# EAGLE design IoT_2015-1 (EAGLE 7.2.0)
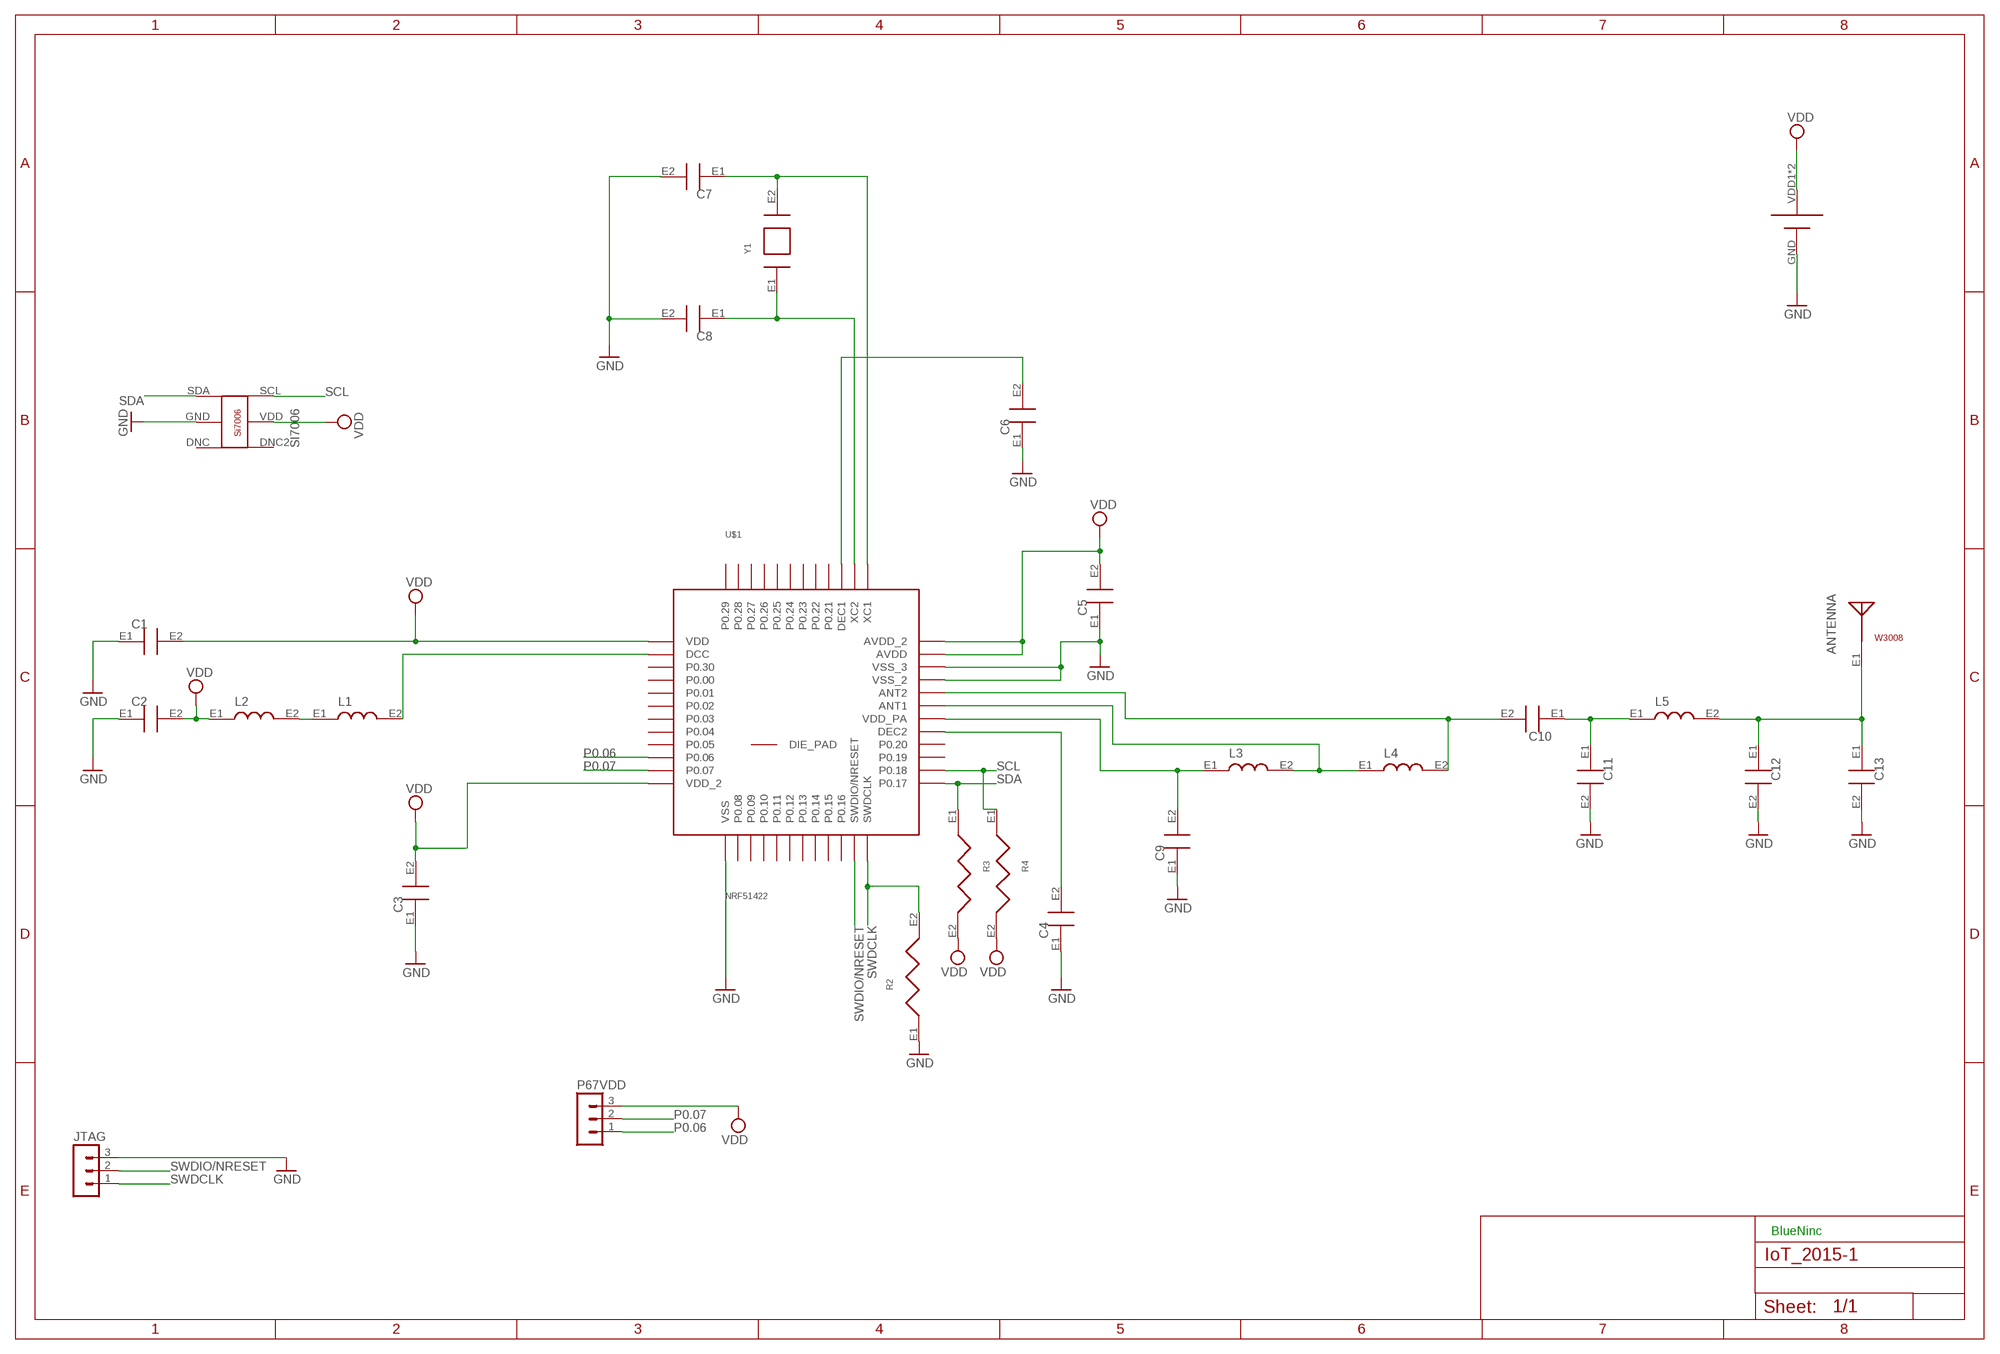
[diagram p0: schematic, sheet 1]

## Parts
ANTENNA  W3008  [W3008]
BATTERY  BAT-HLD-001  [BAT-HLD-001]
C1  VJ1603_W1BC  [VJ1603_W1BC]
C2  VJ1603_W1BC  [VJ1603_W1BC]
C3  VJ1603_W1BC  [VJ1603_W1BC]
C4  VJ1603_W1BC  [VJ1603_W1BC]
C5  VJ1603_W1BC  [VJ1603_W1BC]
C6  VJ1603_W1BC  [VJ1603_W1BC]
C7  VJ1603_W1BC  [VJ1603_W1BC]
C8  VJ1603_W1BC  [VJ1603_W1BC]
C9  VJ1603_W1BC  [VJ1603_W1BC]
C10  VJ1603_W1BC  [VJ1603_W1BC]
C11  VJ1603_W1BC  [VJ1603_W1BC]
C12  VJ1603_W1BC  [VJ1603_W1BC]
C13  VJ1603_W1BC  [VJ1603_W1BC]
JTAG  MA03-1  [MA03-1]
L1  JTI_CAT_2012_INDUCTORS_CHIP-242427  [JTI_CAT_2012_INDUCTORS_CHIP-242427]
L2  JTI_CAT_2012_INDUCTORS_CHIP-242427  [JTI_CAT_2012_INDUCTORS_CHIP-242427]
L3  JTI_CAT_2012_INDUCTORS_CHIP-242427  [JTI_CAT_2012_INDUCTORS_CHIP-242427]
L4  JTI_CAT_2012_INDUCTORS_CHIP-242427  [JTI_CAT_2012_INDUCTORS_CHIP-242427]
L5  JTI_CAT_2012_INDUCTORS_CHIP-242427  [JTI_CAT_2012_INDUCTORS_CHIP-242427]
P67VDD  MA03-1  [MA03-1]
R2  ERJ-3GEYJ103V  [ERJ-3GEYJ103V]
R3  ERJ-3GEYJ103V  [ERJ-3GEYJ103V]
R4  ERJ-3GEYJ103V  [ERJ-3GEYJ103V]
SI7006  SI7006-A20-IM  [SI7006-A20-IM]
U$1  NRF51422  [QFN48]
Y1  ABLS-16.000MHZ-B4-T  [ABLS-16.000MHZ-B4-T]

## Nets
GND: BATTERY.GND C1.E1 C2.E1 C3.E1 C4.E1 C5.E1 C6.E1 C7.E2 C8.E2 C9.E1 C11.E2 C12.E2 C13.E2 JTAG.3 R2.E1 SI7006.GND U$1.13(VSS) U$1.33(VSS_2) U$1.34(VSS_3)
N$1: L1.E1 L2.E2
N$2: L1.E2 U$1.2(DCC)
N$3: C4.E2 U$1.29(DEC2)
N$4: ANTENNA.E1 C12.E1 C13.E1 L5.E2
N$5: C9.E2 L3.E1 U$1.30(VDD_PA)
N$6: L3.E2 L4.E1 U$1.31(ANT1)
N$7: C10.E2 L4.E2 U$1.32(ANT2)
N$8: C6.E2 U$1.39(DEC1)
N$9: C8.E1 U$1.38(XC2) Y1.E1
N$10: C7.E1 U$1.37(XC1) Y1.E2
N$11: C10.E1 C11.E1 L5.E1
P0.06: P67VDD.1 U$1.10(P0.06)
P0.07: P67VDD.2 U$1.11(P0.07)
SCL: R4.E1 SI7006.SCL U$1.26(P0.18)
SDA: R3.E1 SI7006.SDA U$1.25(P0.17)
SWDCLK: JTAG.1 R2.E2 U$1.24(SWDCLK)
SWDIO/NRESET: JTAG.2 U$1.23(SWDIO/NRESET)
VDD: BATTERY.VDD1(VDD) BATTERY.VDD2(VDD) C1.E2 C2.E2 C3.E2 C5.E2 L2.E1 P67VDD.3 R3.E2 R4.E2 SI7006.VDD U$1.1(VDD) U$1.12(VDD_2) U$1.35(AVDD) U$1.36(AVDD_2)
Unconnected: SI7006.DNC SI7006.DNC2 U$1.3(P0.30) U$1.4(P0.00) U$1.5(P0.01) U$1.6(P0.02) U$1.7(P0.03) U$1.8(P0.04) U$1.9(P0.05) U$1.14(P0.08) U$1.15(P0.09) U$1.16(P0.10) U$1.17(P0.11) U$1.18(P0.12) U$1.19(P0.13) U$1.20(P0.14) U$1.21(P0.15) U$1.22(P0.16) U$1.27(P0.19) U$1.28(P0.20) U$1.40(P0.21) U$1.41(P0.22) U$1.42(P0.23) U$1.43(P0.24) U$1.44(P0.25) U$1.45(P0.26) U$1.46(P0.27) U$1.47(P0.28) U$1.48(P0.29) U$1.GND(DIE_PAD)

## Notes on the sheet
- BlueNinc

## Library data of the parts
ANTENNA = Pulse:W3008
BATTERY = BAT-HLD-001:BAT-HLD-001
C1-C13 = Vishay:VJ1603_W1BC
JTAG P67VDD = custom-con-lstb:MA03-1: PIN HEADER; OC_FARNELL: unknown; OC_NEWARK: unknown
L1-L5 = JohansonTechnology:JTI_CAT_2012_INDUCTORS_CHIP-242427
R2-R4 = Panasonic:ERJ-3GEYJ103V
SI7006 = SiliconLabs:SI7006-A20-IM
U$1 = NordicSemi:NRF51422: Bluetooth 4.0 Low Energy/2.4Ghz NORDIC SEMICONDUCTOR
Y1 = Abracon:ABLS-16.000MHZ-B4-T

## Board
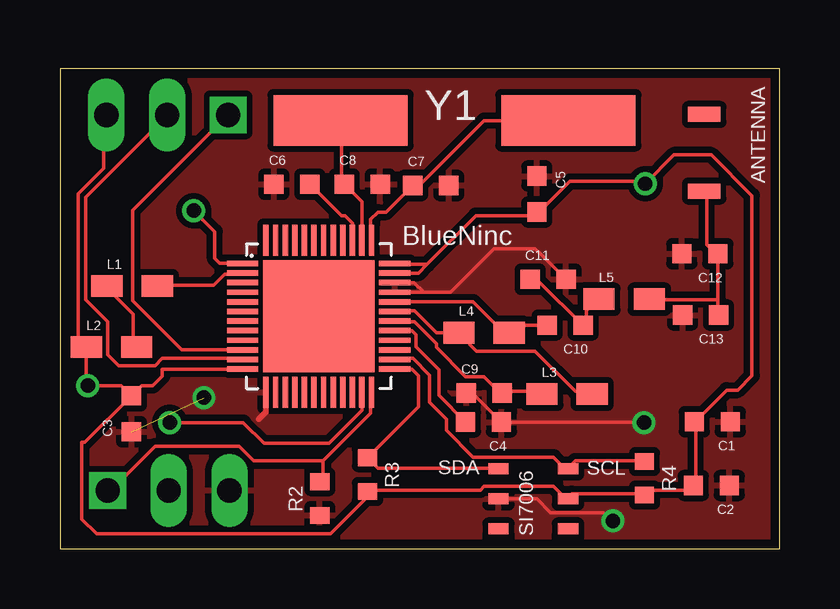
[diagram p1: board, top side]
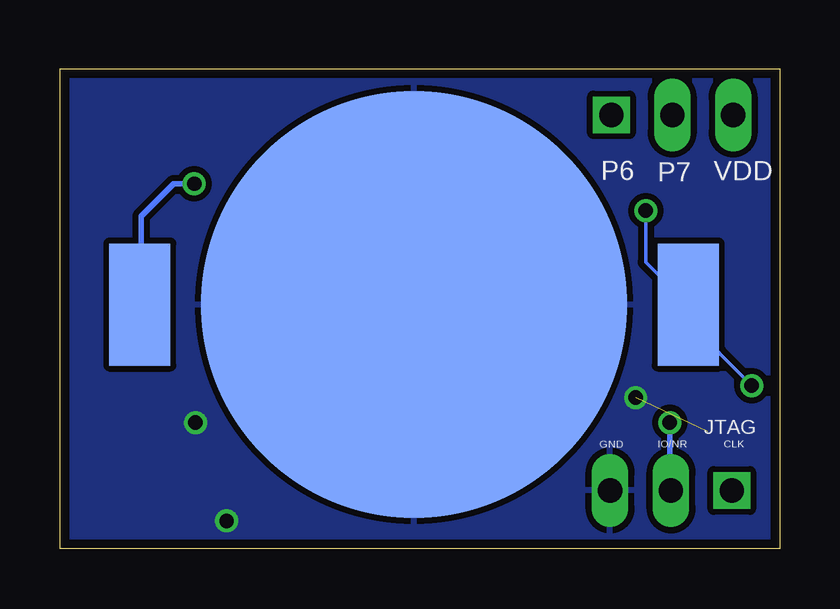
[diagram p2: board, bottom side, seen from below]

Size 30 x 20 mm. Coordinates in mm from the lower left corner, seen from the top.
Outline: 30,0 30,20 0,20 0,0 30,0
Copper layers (1*16): Top 0.0356mm / dielectric 1.5011mm / Bottom 0.0356mm
Design rules "LaenPCBOrder": minimum track width 6mil, minimum drill 13mil, track to track 6mil, track to pad 6mil, pad to pad 6mil, via to via 6mil, smd to smd 6mil, copper to edge 15mil, drill to drill 6mil, minimum pad ring 7mil, minimum via ring 7mil, stop-mask expansion 3mil, vias tented up to drill 0mil, thermal gap 10mil

### Footprints (pad centres in the part's own frame; a part is rotated, then mirrored left to right if it is on the bottom)
W3008 = smd 0.62 x 1.36: E1 -1.6,0; E2 1.6,0
BAT-HLD-001 = smd 17.78 x 17.78: GND 0,0 | smd 2.54 x 5.08: VDD1 -11.43,0; VDD2 11.43,0
VJ1603_W1BC = smd 0.8 x 0.8: E1 -0.75,0; E2 0.75,0
MA03-1 = drill 1.016 square: 1 -2.54,0 | drill 1.016 long: 2 0,0; 3 2.54,0
JTI_CAT_2012_INDUCTORS_CHIP-242427 = smd 1.3 x 0.9: E1 -1.05,0; E2 1.05,0
ERJ-3GEYJ103V = smd 0.7 x 0.8: E1 -0.7,0; E2 0.7,0
SI7006-A20-IM = smd 0.85 x 0.45: DNC -1.45,-1.25; DNC2 1.45,-1.25; GND -1.45,0; SCL 1.45,1.25; SDA -1.45,1.25; VDD 1.45,0
QFN48 = smd 1.3 x 0.226: 1 -3.17,2.2; 2 -3.17,1.8; 3 -3.17,1.4; 4 -3.17,1; 5 -3.17,0.6; 6 -3.17,0.2; 7 -3.17,-0.2; 8 -3.17,-0.6; 9 -3.17,-1; 10 -3.17,-1.4; 11 -3.17,-1.8; 12 -3.17,-2.2; 25 3.17,-2.2; 26 3.17,-1.8; 27 3.17,-1.4; 28 3.17,-1; 29 3.17,-0.6; 30 3.17,-0.2; 31 3.17,0.2; 32 3.17,0.6; 33 3.17,1; 34 3.17,1.4; 35 3.17,1.8; 36 3.17,2.2 | smd 0.226 x 1.3: 13 -2.2,-3.17; 14 -1.8,-3.17; 15 -1.4,-3.17; 16 -1,-3.17; 17 -0.6,-3.17; 18 -0.2,-3.17; 19 0.2,-3.17; 20 0.6,-3.17; 21 1,-3.17; 22 1.4,-3.17; 23 1.8,-3.17; 24 2.2,-3.17; 37 2.2,3.17; 38 1.8,3.17; 39 1.4,3.17; 40 1,3.17; 41 0.6,3.17; 42 0.2,3.17; 43 -0.2,3.17; 44 -0.6,3.17; 45 -1,3.17; 46 -1.4,3.17; 47 -1.8,3.17; 48 -2.2,3.17 | smd 4.66 x 4.66: GND 0,0
ABLS-16.000MHZ-B4-T = smd 5.588 x 2.108: E1 -4.75,0; E2 4.75,0

### Placement (x,y rotation side)
ANTENNA  26.86,16.49 90 top
BATTERY  15.24,10.16 0 bottom
C1  27.2,5.28 180 top
C2  27.16,2.63 180 top
C3  2.98,5.62 90 top
C4  17.66,5.27 180 top
C5  19.88,14.77 270 top
C6  9.67,15.18 0 top
C7  15.46,15.13 0 top
C8  12.6,15.18 0 top
C9  17.69,6.48 0 top
C10  21.06,9.31 180 top
C11  20.35,11.22 0 top
C12  26.68,12.28 180 top
C13  26.71,9.73 180 top
JTAG  4.53,2.42 0 top
L1  3.01,10.94 0 top
L2  2.15,8.39 0 top
L3  21.14,6.44 0 top
L4  17.68,8.99 0 top
L5  23.52,10.39 0 top
P67VDD  4.47,18.07 180 top
R2  10.83,2.08 90 top
R3  12.82,3.08 270 top
R4  24.37,2.93 270 top
SI7006  19.73,2.07 0 top
U$1  10.79,9.68 0 top
Y1  16.45,17.84 0 top

### Tracks (layer width: path | path; a pad name or v marks a point on that pad's centre or on a via)
GND  (via drill 0.6)  (1 unrouted)
  Top 0.152: C9.E1 17.2,6.48 C4.E1 24.33,5.27 v24.35,5.25 | SI7006.GND 19.88,2.07 20.45,1.5 22.65,1.5 22.7,1.45 22.75,1.45 v23.05,1.15 | U$1.33 15.17,10.68 | 15.17,10.68 16.28,10.68 18.1,12.5 19.8,12.5 19.95,12.35 19.97,12.35 C11.E2 | U$1.34 14.77,11.08 15.17,10.68
  Top 0.225: U$1.13 8.59,5.7 8.28,5.39
  other vias: 6,6.29
  pour Top (isolate 0.254): 0,0 0,20 30,20 30,0
  pour Bottom (isolate 0.254): 0,0 0,20 30,20 30,0
N$1
  Top 0.152: L2.E2 3.05,8.53 3.05,9.75 1.98,10.82 L1.E1
N$2
  Top 0.152: L1.E2 4.12,10.97 6.4,10.97 6.86,11.43 7.62,11.43 U$1.2
N$3
  Top 0.152: U$1.29 14.67,9.08 14.85,8.9 14.85,8.4 15.8,7.45 15.8,6.38 C4.E2
N$4
  Top 0.152: 27.43,10.36 27.43,9.75 C13.E1 | 27.43,10.36 27.43,12.19 C12.E1 27.28,12.34 26.98,12.65 26.98,14.78 ANTENNA.E1 | 27.43,10.36 24.69,10.36 L5.E2
N$5
  Top 0.152: L3.E1 19.96,6.55 18.44,6.55 C9.E2 18.29,6.55 17.68,7.16 16.92,7.16 15.7,8.38 15.7,8.53 14.78,9.45 14.02,9.45 U$1.30
N$6
  Top 0.152: U$1.31 14.02,9.91 14.78,9.91 15.7,8.99 16.61,8.99 L4.E1 16.76,8.84 17.37,8.23 19.81,8.23 21.49,6.55 22.1,6.55 L3.E2
N$7
  Top 0.152: C10.E2 20.27,9.3 19.05,9.3 18.75,8.99 L4.E2 18.47,9.25 18.25,9.25 17.22,10.28 U$1.32
N$8
  Top 0.152: C6.E2 10.52,15.09 11.73,13.87 11.89,13.87 12.19,13.56 12.19,12.95 U$1.39
N$9
  Top 0.152: Y1.E1 11.73,17.83 11.73,15.24 C8.E1 12.59,14.44 U$1.38
N$10
  Top 0.152: 14.63,15.09 C7.E1 | U$1.37 12.95,12.95 12.95,13.71 13.26,14.02 13.6,14.02 C7.E1 | C7.E1 14.78,15.24 15.09,15.24 17.68,17.83 21.18,17.83 Y1.E2
N$11
  Top 0.152: L5.E1 22.4,10.36 21.95,9.91 21.95,9.45 C10.E1 21.79,9.3 19.96,11.12 19.66,11.12 C11.E1
P0.06
  Top 0.152: U$1.10 5.07,8.28 3.03,10.32 3.03,14.09 P67VDD.1
P0.07
  Top 0.152: U$1.11 7.62,7.92 4.27,7.92 3.96,7.62 2.44,7.62 1.98,8.08 1.98,9.45 1.07,10.36 1.07,14.63 4.42,17.98 P67VDD.2
SCL
  Top 0.152: U$1.26 14.02,7.92 14.71,7.92 15.41,7.23 15.41,6.09 16.11,5.39 16.11,4.92 17.22,3.81 20.57,3.81 21.03,3.35 SI7006.SCL 21.18,3.35 21.49,3.66 24.34,3.66 R4.E1
SDA
  Top 0.152: 12.95,3.81 R3.E1 | U$1.25 13.87,7.47 14.67,7.47 14.95,7.19 14.95,5.91 R3.E1 | SI7006.SDA 18.14,3.35 13.26,3.35 12.95,3.66 R3.E1
SWDCLK
  Top 0.152: 10.97,3.66 10.97,2.9 R2.E2 | 10.97,3.66 12.95,5.64 12.95,6.4 U$1.24 | 10.97,3.66 8.08,3.66 7.47,4.27 3.96,4.27 2.13,2.44 JTAG.1
SWDIO/NRESET  (via drill 0.6)
  Top 0.152: U$1.23 12.59,5.76 11.21,4.38 8.51,4.38 7.64,5.25 v4.58,5.25
  Bottom 0.225: v4.58,5.25 4.58,2.47 JTAG.2
VDD  (via drill 0.6)
  Top 0.152: 1.22,8.38 L2.E1 | U$1.12 7.62,7.47 4.27,7.47 4.27,7.19 3.87,6.79 3.4,6.79 C3.E2 | P67VDD.3 1.83,17.98 1.83,15.85 0.76,14.78 0.76,8.84 1.07,8.53 L2.E1 | 14.02,11.89 U$1.36 14,11.84 15.31,11.84 | U$1.35 14.95,11.48 15.31,11.84 | 15.31,11.84 17.34,13.87 19.81,13.87 C5.E2 19.96,13.87 19.96,14.01 21.25,15.3 24.3,15.3 v24.4,15.2 25.6,16.4 27.15,16.4 28.85,14.7 28.85,7.2 28.25,6.6 27.8,6.6 26.48,5.28 C1.E2 26.52,5.21 26.52,2.74 C2.E2 26.36,2.59 26.21,2.44 24.58,2.44 R4.E2 24.31,2.29 21.34,2.29 21.18,2.13 SI7006.VDD 21.03,2.13 20.57,2.59 17.68,2.59 17.53,2.44 12.95,2.44 R3.E2 12.95,2.29 11.28,0.61 1.52,0.61 0.91,1.22 0.91,4.42 1.03,4.42 C3.E2 | U$1.1 6.66,11.88 6.45,12.09 6.45,13.21 v5.58,14.08 | C3.E2 2.56,6.79 v1.16,6.79 1.1,6.85 L2.E1
  Bottom 0.152: v5.58,14.08 5.58,11.93 BATTERY.VDD2 3.81,9.44 v1.16,6.79
  Bottom 0.225: v24.4,15.2 25.27,15.2 26.62,13.85 26.62,10.21 BATTERY.VDD1

### Text on the board
tNames: BlueNinc
bNames: VDD | P7 | P6 | JTAG | CLK | IO/NR | GND